# Altium schematic sheet HDMI out.SchDoc
size A4; Organization: Blinkinlabs, LLC
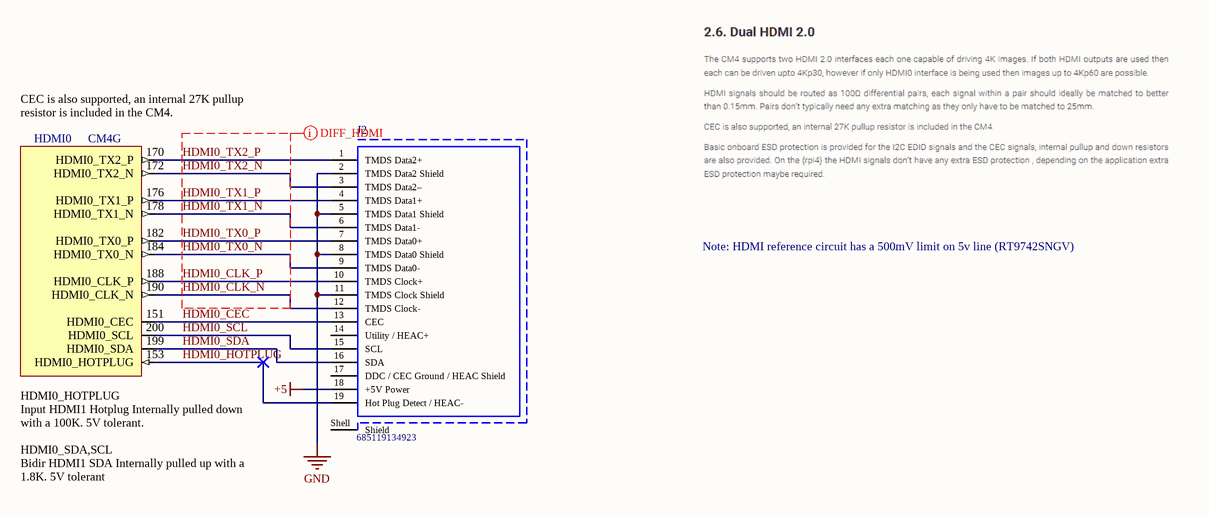
[diagram p0: HDMI out.SchDoc]

## Parts
CM4  Raspberry Pi Compute Module 4  [CM4-F40C-100DS-0.4v_1.5mm_0mm]  (value not drawn)  (part G of 21)
J2  685119134923  [685119134923]

## Nets
+5: J2.18(+5V_Power)
GND: J2.2(TMDS_Data2_Shield) J2.5(TMDS_Data1_Shield) J2.8(TMDS_Data0_Shield) J2.11(TMDS_Clock_Shield)
HDMI0_CEC: CM4.151(HDMI0_CEC) J2.13(CEC)
HDMI0_CLK_N: CM4.190(HDMI0_CLK_N) J2.12(TMDS_Clock-)
HDMI0_CLK_P: CM4.188(HDMI0_CLK_P) J2.10(TMDS_Clock+)
HDMI0_HOTPLUG: CM4.153(HDMI0_HOTPLUG) J2.19(Hot_Plug_Detect_/_HEAC-)
HDMI0_SCL: CM4.200(HDMI0_SCL) J2.15(SCL)
HDMI0_SDA: CM4.199(HDMI0_SDA) J2.16(SDA)
HDMI0_TX0_N: CM4.184(HDMI0_TX0_N) J2.9(TMDS_Data0-)
HDMI0_TX0_P: CM4.182(HDMI0_TX0_P) J2.7(TMDS_Data0+)
HDMI0_TX1_N: CM4.178(HDMI0_TX1_N) J2.6(TMDS_Data1-)
HDMI0_TX1_P: CM4.176(HDMI0_TX1_P) J2.4(TMDS_Data1+)
HDMI0_TX2_N: CM4.172(HDMI0_TX2_N) J2.3(TMDS_Data2–)
HDMI0_TX2_P: CM4.170(HDMI0_TX2_P) J2.1(TMDS_Data2+)

Not connected (* = marked no-connect by the designer): J2 14(Utility_/_HEAC+) 17(DDC_/_CEC_Ground_/_HEAC_Shield) Shell(Shield)

## Layout directives
differential pair; differential pair class DIFF_100Ohm_HDMI; differential pair class DIFF_HDMI; net class HDMI; rule Matched Net Lengths [Tolerance = 0.15mm]: HDMI0_CLK_N, HDMI0_CLK_P, HDMI0_TX0_N, HDMI0_TX0_P, HDMI0_TX1_N, HDMI0_TX1_P, HDMI0_TX2_N, HDMI0_TX2_P

## Notes on the sheet
- Note: HDMI reference circuit has a 500mV limit on 5v line (RT9742SNGV)
- Title:
- Project:
- Revision:
- Date:
- Time:
- Sheet
- of
- (in symbol CM4, part G) CEC is also supported, an internal 27K pullup resistor is included in the CM4.; HDMI0; HDMI0_HOTPLUG / Input HDMI1 Hotplug Internally pulled down with a 100K. 5V tolerant.; HDMI0_SDA,SCL / Bidir HDMI1 SDA Internally pulled up with a 1.8K. 5V tolerant

## Library data of the parts
CM4 = CM4: Raspberry Pi Compute Module 4 by Amornthep Phunsin
J2 = CMP-1502-00169-1: HDMI Type A Receptacle WR-HDMI, Horizontal, SMT; Manufacturer: Wurth Elektronik; Contact Resistance: 30mOhm; Working Voltage: 40VDC; Rated Current: 0.5A; Publisher: WurthElektronik; Datasheet URL: https://katalog.we-online.de/em/datasheet/685119134923.pdf; Gender: Receptacle; Manufacturer URL: http://www.we-online.de; Orientation: Horizontal; Mounting Technology: SMT; Part Number: 685119134923; Packaging: TapeandReel; Package Reference: 685119134923; Operating Temperature: -20to85degC; Connector Type: HDMITypeA